# Altium schematic sheet GSM eSIM.SchDoc: GSM eSIM
size 292 x 193 mm; SheetNumber: 14; SheetTotal: 42
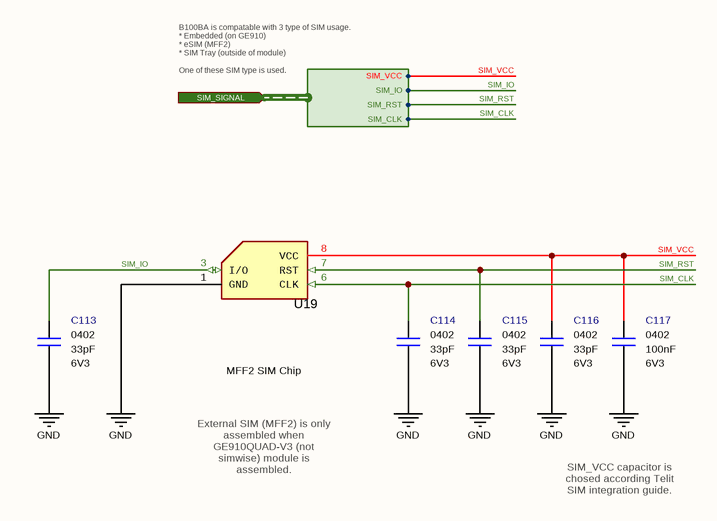
[diagram p0: GSM eSIM.SchDoc]

## Parts
C113  value 33pF  Case: 0402  Voltage: 6V3  [CAPACITOR_0402]  (hidden comment: Multilayer Ceramic Capacitor)
C114  value 33pF  Case: 0402  Voltage: 6V3  [CAPACITOR_0402]  (hidden comment: Multilayer Ceramic Capacitor)
C115  value 33pF  Case: 0402  Voltage: 6V3  [CAPACITOR_0402]  (hidden comment: Multilayer Ceramic Capacitor)
C116  value 33pF  Case: 0402  Voltage: 6V3  [CAPACITOR_0402]  (hidden comment: Multilayer Ceramic Capacitor)
C117  value 100nF  Case: 0402  Voltage: 6V3  [CAPACITOR_0402]  (hidden comment: Multilayer Ceramic Capacitor)
U19  MFF2 SIM Chip  [MFF2]

## Ports
SIM_SIGNAL (in, harness SIM_SIGNAL)

## Harnesses
SIM_SIGNAL: SIM_VCC, SIM_IO, SIM_RST, SIM_CLK

## Nets
GND: C113.1 C114.1 C115.1 C116.1 C117.1 U19.1(GND)
SIM_CLK: C114.2 U19.6(CLK) ; port SIM_SIGNAL.SIM_CLK
SIM_IO: C113.2 U19.3(I/O) ; port SIM_SIGNAL.SIM_IO
SIM_RST: C115.2 U19.7(RST) ; port SIM_SIGNAL.SIM_RST
SIM_VCC: C116.2 C117.2 U19.8(VCC) ; port SIM_SIGNAL.SIM_VCC

Not connected (* = marked no-connect by the designer): U19 2(NC) 4(NC) 5(NC)

## Notes on the sheet
- B100BA is compatable with 3 type of SIM usage.
  * Embedded (on GE910)
  * eSIM (MFF2)
  * SIM Tray (outside of module)
  One of these SIM type is used.
- External SIM (MFF2) is only assembled when GE910QUAD-V3 (not simwise) module is assembled.
- SIM_VCC capacitor is chosed according Telit SIM integration guide.
- © 2021 All rights reserved.
  This document may not, in whole or in part, be copied, photocopied, reproduced, translated or converted to any electronic or machine readable from without prior written permission of Mehmet Günce Akkoyun.
  Engineer contact : akkoyun@me.com
- Property of
- Engineer :
- Date :
- Size :
- A4
- Time :
- Project :
- Page :
- /
- Customer :
- Product ID :
- Module ID :
- Version :
- File :
- Revision :

## Library data of the parts
C113-C116 = Capacitor - 33pF [0402-6V3]: Capacitor - 33pF [0402] (Ceramic); Manufacturer Name: Kemet; Manufacturer Part Number: C0402C330J9RACAUTO; Dielectric: X7R; Tolerance: 10%; Height: 0.5mm; Maximum Operating Temperature: +125; Minimum Operating Temperature: -55; ROHS: Yes; ComponentLink1Description: DataSheet; ComponentLink1URL: https://api.kemet.com/component-edge/download/datasheet/C0402C330J9RACAUTO.pdf; ComponentLink2Description: Mouser; ComponentLink2URL: https://www.mouser.com/Search/Refine.aspx?Keyword=80-C0402C330J9RAUTO; Supplier 1: Mouser; Supplier Part Number 1: 80-C0402C330J9RAUTO; Mouser Part Number: 80-C0402C330J9RAUTO
C117 = Capacitor - 100nF [0402-6V3]: Capacitor - 100nF [0402-6V3] (Ceramic); Manufacturer Name: AVX; Manufacturer Part Number: 04026D104KAT4A; Dielectric: X5R; Tolerance: %10; Height: 0.25mm; ComponentLink1Description: Mouser; ComponentLink1URL: https://www.mouser.com.tr/ProductDetail/AVX/04026D104KAT4A?qs=sGAEpiMZZMs0AnBnWHyRQPg4iYkCw7IMED%2F4kpqgf7w%3D; ComponentLink2Description: DataSheet; ComponentLink2URL: https://www.mouser.com.tr/datasheet/2/40/cx5r-776519.pdf; ROHS: Yes; Maximum Operating Temperature: +85; Minimum Operating Temperature: -55; Supplier 1: Avnet; Supplier Part Number 1: 04026D104KAT4A; Mouser Part Number: 581-04026D104KAT4A
U19 = IC - MFF2: SIM Chip MFF2